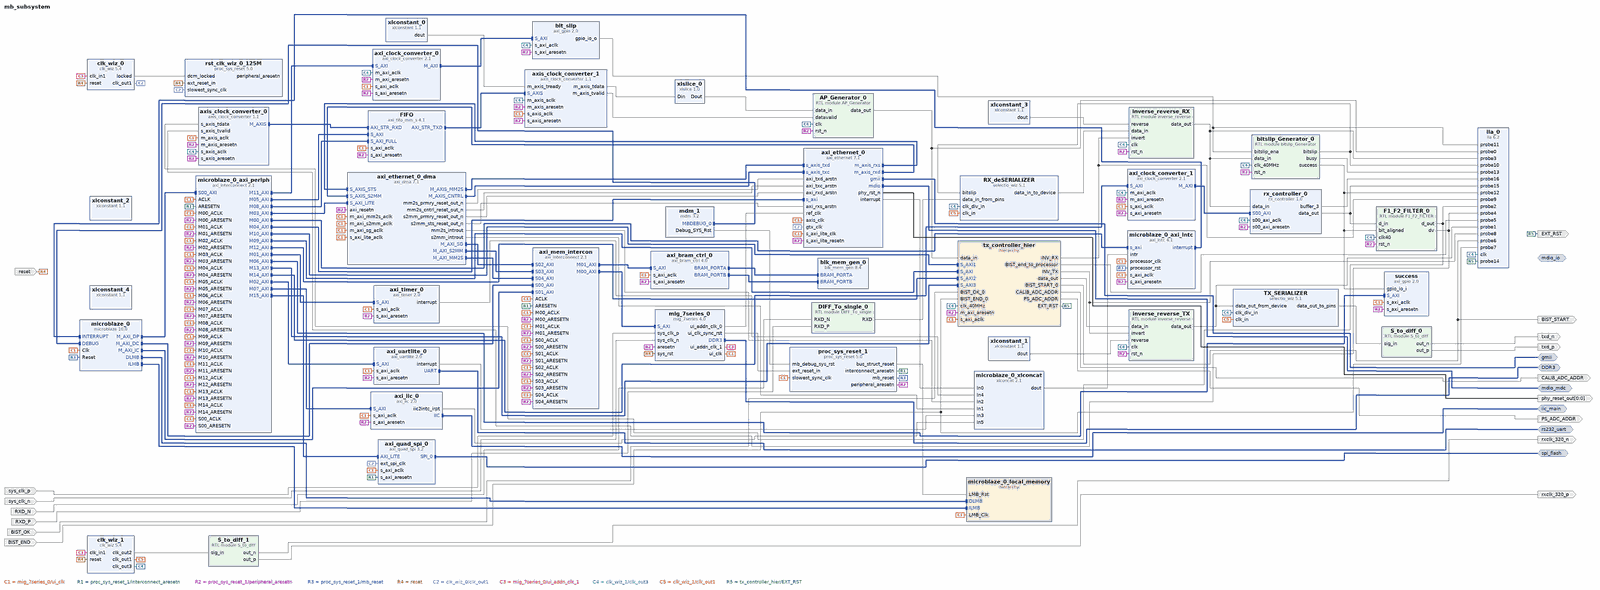
[diagram p0: block diagram of the top level, whole]
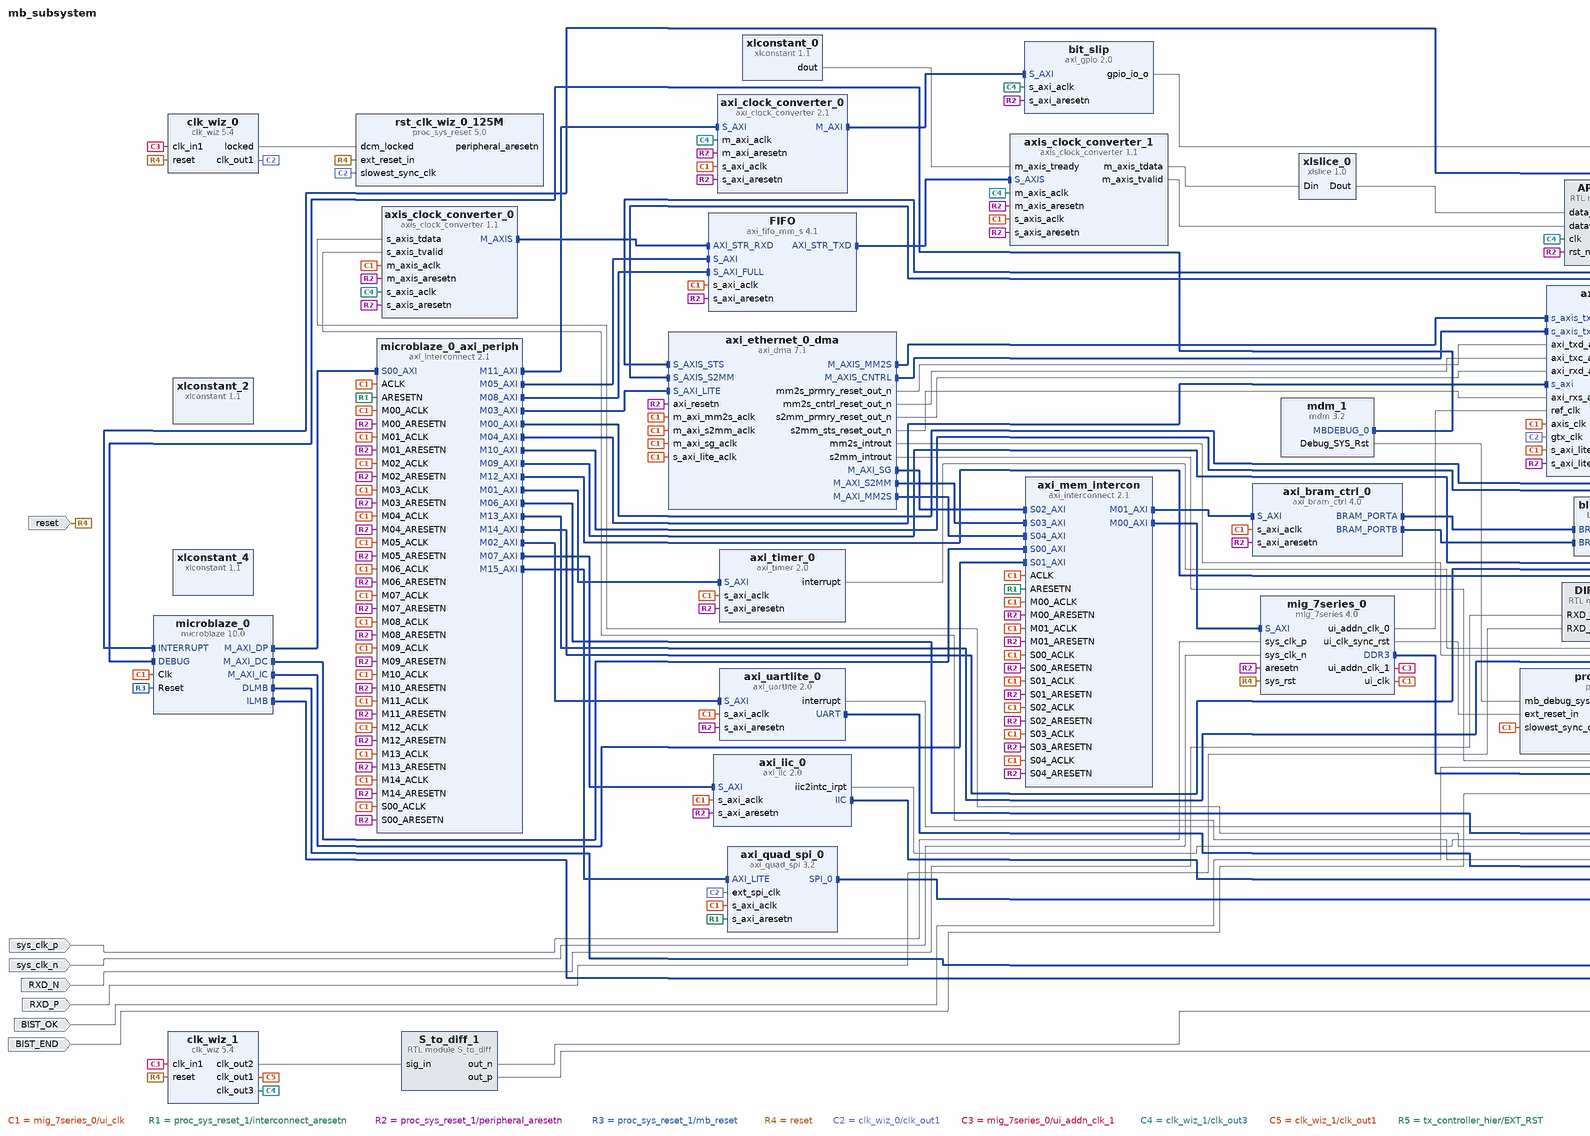
[diagram p1: block diagram of the top level, left part]
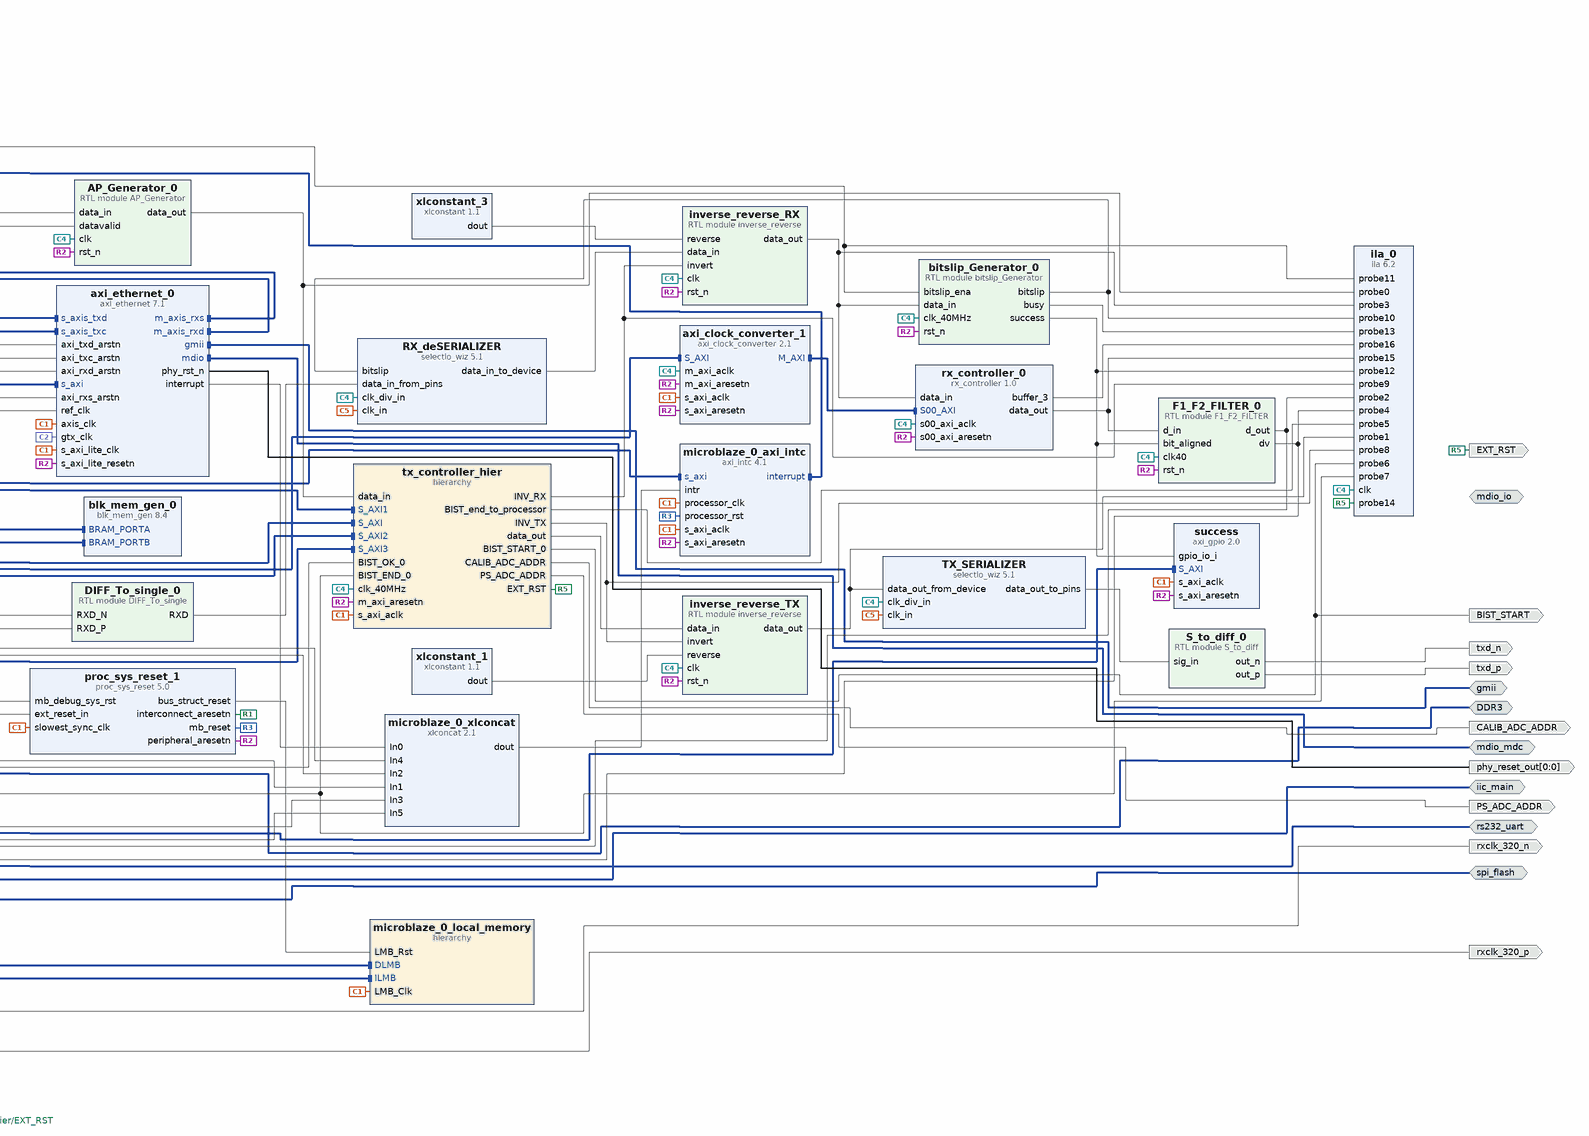
[diagram p2: block diagram of the top level, right part]
# Vivado block design mb_subsystem, xc7k325tffg900-2, Vivado 2017.4
create_bd_design mb_subsystem

create_bd_intf_port -mode Master -vlnv xilinx.com:interface:uart_rtl:1.0 rs232_uart
create_bd_intf_port -mode Master -vlnv xilinx.com:interface:ddrx_rtl:1.0 DDR3
create_bd_intf_port -mode Master -vlnv xilinx.com:interface:gmii_rtl:1.0 gmii
create_bd_intf_port -mode Master -vlnv xilinx.com:interface:mdio_rtl:1.0 mdio_mdc
create_bd_intf_port -mode Master -vlnv xilinx.com:interface:iic_rtl:1.0 iic_main
create_bd_intf_port -mode Master -vlnv xilinx.com:interface:spi_rtl:1.0 spi_flash
create_bd_intf_port -mode Master -vlnv xilinx.com:interface:mdio_io:1.0 mdio_io
create_bd_port -dir I sys_clk_p
create_bd_port -dir I sys_clk_n
create_bd_port -dir I -type rst reset
set_property -dict {CONFIG.POLARITY ACTIVE_HIGH} [get_bd_ports reset]
create_bd_port -dir O -from 0 -to 0 -type rst phy_reset_out
create_bd_port -dir I RXD_N
create_bd_port -dir I RXD_P
create_bd_port -dir O txd_p
create_bd_port -dir O txd_n
create_bd_port -dir O rxclk_320_n
create_bd_port -dir O rxclk_320_p
create_bd_port -dir I BIST_OK
create_bd_port -dir I BIST_END
create_bd_port -dir O BIST_START
create_bd_port -dir O PS_ADC_ADDR
create_bd_port -dir O CALIB_ADC_ADDR
create_bd_port -dir O EXT_RST

create_bd_cell -type hier microblaze_0_local_memory
create_bd_cell -type ip -vlnv xilinx.com:ip:axi_intc:4.1 microblaze_0_axi_intc
set_property -dict {CONFIG.C_HAS_FAST 1} [get_bd_cells microblaze_0_axi_intc]
create_bd_cell -type ip -vlnv xilinx.com:ip:xlconcat:2.1 microblaze_0_xlconcat
set_property -dict {CONFIG.NUM_PORTS 6 CONFIG.dout_width 6} [get_bd_cells microblaze_0_xlconcat]
create_bd_cell -type module -reference S_to_diff S_to_diff_0
create_bd_cell -type module -reference S_to_diff S_to_diff_1
create_bd_cell -type module -reference DIFF_To_single DIFF_To_single_0
create_bd_cell -type module -reference inverse_reverse inverse_reverse_RX
create_bd_cell -type module -reference F1_F2_FILTER F1_F2_FILTER_0
create_bd_cell -type ip -vlnv xilinx.com:ip:xlconstant:1.1 xlconstant_0
create_bd_cell -type ip -vlnv xilinx.com:ip:xlslice:1.0 xlslice_0
set_property -dict {CONFIG.DIN_TO 0 CONFIG.DIN_FROM 7 CONFIG.DOUT_WIDTH 8} [get_bd_cells xlslice_0]
create_bd_cell -type module -reference AP_Generator AP_Generator_0
create_bd_cell -type module -reference inverse_reverse inverse_reverse_TX
create_bd_cell -type ip -vlnv xilinx.com:ip:selectio_wiz:5.1 RX_deSERIALIZER
set_property -dict [list \
  CONFIG.BUS_DIR INPUTS \
  CONFIG.BUS_IO_STD LVCMOS25 \
  CONFIG.USE_SERIALIZATION true \
  CONFIG.SERIALIZATION_FACTOR 8 \
  CONFIG.SYSTEM_DATA_WIDTH 1 \
  CONFIG.SELIO_INTERFACE_TYPE NETWORKING \
  CONFIG.SELIO_BUS_IN_DELAY NONE \
  CONFIG.SELIO_CLK_IO_STD LVCMOS25 \
  CONFIG.SELIO_CLK_BUF MMCM \
  CONFIG.CLK_FWD_IO_STD LVCMOS25 \
] [get_bd_cells RX_deSERIALIZER]
create_bd_cell -type ip -vlnv xilinx.com:ip:axi_bram_ctrl:4.0 axi_bram_ctrl_0
set_property -dict {CONFIG.C_SELECT_XPM 0} [get_bd_cells axi_bram_ctrl_0]
create_bd_cell -type ip -vlnv xilinx.com:ip:axi_clock_converter:2.1 axi_clock_converter_0
create_bd_cell -type ip -vlnv xilinx.com:ip:axi_ethernet:7.1 axi_ethernet_0
set_property -dict [list \
  CONFIG.ETHERNET_BOARD_INTERFACE gmii \
  CONFIG.PHYRST_BOARD_INTERFACE phy_reset_out \
  CONFIG.MDIO_BOARD_INTERFACE mdio_mdc \
  CONFIG.rxnibblebitslice0used true \
  CONFIG.RXMEM 32k \
  CONFIG.TXMEM 32k \
  CONFIG.TXCSUM Full \
  CONFIG.RXCSUM Full \
] [get_bd_cells axi_ethernet_0]
create_bd_cell -type ip -vlnv xilinx.com:ip:axi_dma:7.1 axi_ethernet_0_dma
set_property -dict [list \
  CONFIG.c_include_mm2s_dre 1 \
  CONFIG.c_mm2s_burst_size 32 \
  CONFIG.c_sg_use_stsapp_length 1 \
  CONFIG.c_include_s2mm_dre 1 \
  CONFIG.c_s2mm_burst_size 32 \
] [get_bd_cells axi_ethernet_0_dma]
create_bd_cell -type ip -vlnv xilinx.com:ip:axi_fifo_mm_s:4.1 FIFO
set_property -dict [list \
  CONFIG.C_DATA_INTERFACE_TYPE 1 \
  CONFIG.C_RX_FIFO_PE_THRESHOLD 2 \
  CONFIG.C_RX_FIFO_PF_THRESHOLD 32763 \
  CONFIG.C_TX_FIFO_PE_THRESHOLD 2 \
  CONFIG.C_TX_FIFO_PF_THRESHOLD 130000 \
  CONFIG.C_RX_FIFO_DEPTH 32768 \
  CONFIG.C_TX_FIFO_DEPTH 131072 \
  CONFIG.C_HAS_AXIS_TDEST false \
  CONFIG.C_AXIS_TDEST_WIDTH 4 \
  CONFIG.C_USE_TX_DATA 1 \
  CONFIG.C_USE_TX_CTRL 0 \
] [get_bd_cells FIFO]
create_bd_cell -type ip -vlnv xilinx.com:ip:axi_gpio:2.0 success
set_property -dict [list \
  CONFIG.C_GPIO_WIDTH 1 \
  CONFIG.C_ALL_INPUTS 1 \
  CONFIG.USE_BOARD_FLOW true \
  CONFIG.GPIO_BOARD_INTERFACE Custom \
] [get_bd_cells success]
create_bd_cell -type ip -vlnv xilinx.com:ip:axi_gpio:2.0 bit_slip
set_property -dict {CONFIG.C_GPIO_WIDTH 1 CONFIG.C_ALL_OUTPUTS 1} [get_bd_cells bit_slip]
create_bd_cell -type ip -vlnv xilinx.com:ip:axi_iic:2.0 axi_iic_0
set_property -dict {CONFIG.USE_BOARD_FLOW true CONFIG.IIC_BOARD_INTERFACE iic_main} [get_bd_cells axi_iic_0]
create_bd_cell -type ip -vlnv xilinx.com:ip:axi_interconnect:2.1 axi_mem_intercon
set_property -dict [list \
  CONFIG.NUM_SI 5 \
  CONFIG.NUM_MI 2 \
  CONFIG.STRATEGY 2 \
  CONFIG.SYNCHRONIZATION_STAGES 2 \
  CONFIG.M00_HAS_REGSLICE 4 \
  CONFIG.M01_HAS_REGSLICE 4 \
  CONFIG.S00_HAS_REGSLICE 4 \
  CONFIG.S01_HAS_REGSLICE 4 \
  CONFIG.S02_HAS_REGSLICE 4 \
  CONFIG.S03_HAS_REGSLICE 4 \
  CONFIG.S04_HAS_REGSLICE 4 \
  CONFIG.S00_HAS_DATA_FIFO 2 \
  CONFIG.S01_HAS_DATA_FIFO 2 \
  CONFIG.S02_HAS_DATA_FIFO 2 \
  CONFIG.S03_HAS_DATA_FIFO 2 \
  CONFIG.S04_HAS_DATA_FIFO 2 \
] [get_bd_cells axi_mem_intercon]
create_bd_cell -type ip -vlnv xilinx.com:ip:axi_timer:2.0 axi_timer_0
create_bd_cell -type ip -vlnv xilinx.com:ip:axi_uartlite:2.0 axi_uartlite_0
set_property -dict [list \
  CONFIG.C_BAUDRATE 921600 \
  CONFIG.C_S_AXI_ACLK_FREQ_HZ 150150150 \
  CONFIG.USE_BOARD_FLOW true \
  CONFIG.UARTLITE_BOARD_INTERFACE rs232_uart \
] [get_bd_cells axi_uartlite_0]
create_bd_cell -type ip -vlnv xilinx.com:ip:axis_clock_converter:1.1 axis_clock_converter_0
set_property -dict {CONFIG.TDATA_NUM_BYTES 4} [get_bd_cells axis_clock_converter_0]
create_bd_cell -type ip -vlnv xilinx.com:ip:axis_clock_converter:1.1 axis_clock_converter_1
create_bd_cell -type ip -vlnv xilinx.com:ip:blk_mem_gen:8.4 blk_mem_gen_0
set_property -dict [list \
  CONFIG.Memory_Type True_Dual_Port_RAM \
  CONFIG.Enable_B Use_ENB_Pin \
  CONFIG.Use_RSTB_Pin true \
  CONFIG.Port_B_Clock 100 \
  CONFIG.Port_B_Write_Rate 50 \
  CONFIG.Port_B_Enable_Rate 100 \
  CONFIG.EN_SAFETY_CKT false \
] [get_bd_cells blk_mem_gen_0]
create_bd_cell -type ip -vlnv xilinx.com:ip:clk_wiz:5.4 clk_wiz_0
set_property -dict [list \
  CONFIG.CLKIN1_JITTER_PS 83.329999999999998 \
  CONFIG.CLKOUT1_REQUESTED_OUT_FREQ 125 \
  CONFIG.MMCM_DIVCLK_DIVIDE 3 \
  CONFIG.MMCM_CLKFBOUT_MULT_F 25.000 \
  CONFIG.MMCM_CLKIN1_PERIOD 8.333 \
  CONFIG.MMCM_CLKIN2_PERIOD 10.000 \
  CONFIG.MMCM_CLKOUT0_DIVIDE_F 8.000 \
  CONFIG.USE_BOARD_FLOW true \
  CONFIG.RESET_BOARD_INTERFACE reset \
  CONFIG.CLKOUT1_JITTER 165.993 \
  CONFIG.CLKOUT1_PHASE_ERROR 191.950 \
] [get_bd_cells clk_wiz_0]
create_bd_cell -type ip -vlnv xilinx.com:ip:clk_wiz:5.4 clk_wiz_1
set_property -dict [list \
  CONFIG.CLKIN1_JITTER_PS 83.329999999999998 \
  CONFIG.CLKOUT2_USED true \
  CONFIG.CLKOUT3_USED true \
  CONFIG.NUM_OUT_CLKS 3 \
  CONFIG.CLKOUT1_REQUESTED_OUT_FREQ 320 \
  CONFIG.CLKOUT2_REQUESTED_OUT_FREQ 320 \
  CONFIG.CLKOUT2_REQUESTED_PHASE 0 \
  CONFIG.CLKOUT3_REQUESTED_OUT_FREQ 40 \
  CONFIG.PRIM_SOURCE Single_ended_clock_capable_pin \
  CONFIG.MMCM_DIVCLK_DIVIDE 1 \
  CONFIG.MMCM_CLKFBOUT_MULT_F 8.000 \
  CONFIG.MMCM_CLKIN1_PERIOD 8.333 \
  CONFIG.MMCM_CLKIN2_PERIOD 10.000 \
  CONFIG.MMCM_CLKOUT0_DIVIDE_F 3.000 \
  CONFIG.MMCM_CLKOUT1_DIVIDE 3 \
  CONFIG.MMCM_CLKOUT1_PHASE 0.000 \
  CONFIG.MMCM_CLKOUT2_DIVIDE 24 \
  CONFIG.USE_BOARD_FLOW true \
  CONFIG.CLK_IN1_BOARD_INTERFACE Custom \
  CONFIG.RESET_BOARD_INTERFACE reset \
  CONFIG.CLKOUT1_JITTER 102.742 \
  CONFIG.CLKOUT1_PHASE_ERROR 99.820 \
  CONFIG.CLKOUT2_JITTER 102.742 \
  CONFIG.CLKOUT2_PHASE_ERROR 99.820 \
  CONFIG.CLKOUT3_JITTER 154.911 \
  CONFIG.CLKOUT3_PHASE_ERROR 99.820 \
] [get_bd_cells clk_wiz_1]
create_bd_cell -type ip -vlnv xilinx.com:ip:ila:6.2 ila_0
set_property -dict [list \
  CONFIG.C_PROBE16_WIDTH 8 \
  CONFIG.C_PROBE15_WIDTH 8 \
  CONFIG.C_PROBE3_WIDTH 8 \
  CONFIG.C_PROBE2_WIDTH 32 \
  CONFIG.C_PROBE1_WIDTH 8 \
  CONFIG.C_PROBE0_WIDTH 8 \
  CONFIG.C_NUM_OF_PROBES 17 \
  CONFIG.C_ENABLE_ILA_AXI_MON false \
  CONFIG.C_MONITOR_TYPE Native \
] [get_bd_cells ila_0]
create_bd_cell -type ip -vlnv xilinx.com:ip:mdm:3.2 mdm_1
create_bd_cell -type ip -vlnv xilinx.com:ip:microblaze:10.0 microblaze_0
set_property -dict [list \
  CONFIG.C_AREA_OPTIMIZED 2 \
  CONFIG.C_D_AXI 1 \
  CONFIG.C_I_AXI 0 \
  CONFIG.C_ENABLE_DISCRETE_PORTS 0 \
  CONFIG.G_TEMPLATE_LIST 3 \
  CONFIG.G_USE_EXCEPTIONS 0 \
  CONFIG.C_USE_MSR_INSTR 1 \
  CONFIG.C_USE_PCMP_INSTR 1 \
  CONFIG.C_USE_BARREL 1 \
  CONFIG.C_USE_DIV 1 \
  CONFIG.C_USE_HW_MUL 2 \
  CONFIG.C_USE_FPU 2 \
  CONFIG.C_DEBUG_ENABLED 1 \
  CONFIG.C_FSL_LINKS 1 \
  CONFIG.C_USE_EXTENDED_FSL_INSTR 1 \
  CONFIG.C_USE_ICACHE 1 \
  CONFIG.C_ADDR_TAG_BITS 19 \
  CONFIG.C_CACHE_BYTE_SIZE 4096 \
  CONFIG.C_ICACHE_LINE_LEN 4 \
  CONFIG.C_ICACHE_VICTIMS 0 \
  CONFIG.C_ICACHE_STREAMS 0 \
  CONFIG.C_USE_DCACHE 1 \
  CONFIG.C_DCACHE_ADDR_TAG 19 \
  CONFIG.C_DCACHE_BYTE_SIZE 4096 \
  CONFIG.C_DCACHE_LINE_LEN 4 \
  CONFIG.C_DCACHE_USE_WRITEBACK 0 \
  CONFIG.C_USE_MMU 3 \
  CONFIG.C_MMU_DTLB_SIZE 2 \
  CONFIG.C_MMU_ITLB_SIZE 1 \
  CONFIG.C_MMU_ZONES 2 \
  CONFIG.C_USE_BRANCH_TARGET_CACHE 1 \
] [get_bd_cells microblaze_0]
create_bd_cell -type ip -vlnv xilinx.com:ip:axi_interconnect:2.1 microblaze_0_axi_periph
set_property -dict {CONFIG.NUM_SI 1 CONFIG.NUM_MI 16 CONFIG.SYNCHRONIZATION_STAGES 2} [get_bd_cells microblaze_0_axi_periph]
create_bd_cell -type ip -vlnv xilinx.com:ip:mig_7series:4.0 mig_7series_0
set_property -dict [list \
  CONFIG.XML_INPUT_FILE mig_b.prj \
  CONFIG.RESET_BOARD_INTERFACE reset \
  CONFIG.MIG_DONT_TOUCH_PARAM Custom \
  CONFIG.BOARD_MIG_PARAM Custom \
] [get_bd_cells mig_7series_0]
create_bd_cell -type ip -vlnv xilinx.com:ip:proc_sys_reset:5.0 proc_sys_reset_1
create_bd_cell -type ip -vlnv xilinx.com:ip:proc_sys_reset:5.0 rst_clk_wiz_0_125M
set_property -dict {CONFIG.USE_BOARD_FLOW true CONFIG.RESET_BOARD_INTERFACE reset} [get_bd_cells rst_clk_wiz_0_125M]
create_bd_cell -type ip -vlnv xilinx.com:ip:selectio_wiz:5.1 TX_SERIALIZER
set_property -dict [list \
  CONFIG.BUS_DIR OUTPUTS \
  CONFIG.BUS_SIG_TYPE SINGLE \
  CONFIG.BUS_IO_STD LVCMOS25 \
  CONFIG.USE_SERIALIZATION true \
  CONFIG.SERIALIZATION_FACTOR 8 \
  CONFIG.SYSTEM_DATA_WIDTH 1 \
  CONFIG.SELIO_INTERFACE_TYPE NETWORKING \
  CONFIG.SELIO_BUS_IN_DELAY NONE \
  CONFIG.SELIO_CLK_SIG_TYPE SINGLE \
  CONFIG.SELIO_CLK_IO_STD LVCMOS25 \
  CONFIG.SELIO_CLK_BUF MMCM \
  CONFIG.CLK_FWD_SIG_TYPE SINGLE \
  CONFIG.CLK_FWD_IO_STD HSTL_I \
] [get_bd_cells TX_SERIALIZER]
create_bd_cell -type hier tx_controller_hier
create_bd_cell -type ip -vlnv xilinx.com:ip:xlconstant:1.1 xlconstant_1
create_bd_cell -type ip -vlnv xilinx.com:ip:xlconstant:1.1 xlconstant_2
set_property -dict {CONFIG.CONST_VAL 0} [get_bd_cells xlconstant_2]
create_bd_cell -type ip -vlnv xilinx.com:ip:xlconstant:1.1 xlconstant_3
create_bd_cell -type ip -vlnv xilinx.com:ip:xlconstant:1.1 xlconstant_4
set_property -dict {CONFIG.CONST_VAL 0} [get_bd_cells xlconstant_4]
create_bd_cell -type module -reference bitslip_Generator bitslip_Generator_0
create_bd_cell -type ip -vlnv xilinx.com:ip:axi_clock_converter:2.1 axi_clock_converter_1
create_bd_cell -type ip -vlnv cern.ch:user:rx_controller:1.0 rx_controller_0
create_bd_cell -type ip -vlnv xilinx.com:ip:axi_quad_spi:3.2 axi_quad_spi_0
set_property -dict {CONFIG.USE_BOARD_FLOW true CONFIG.QSPI_BOARD_INTERFACE spi_flash} [get_bd_cells axi_quad_spi_0]

# ---- hierarchy /microblaze_0_local_memory ----
current_bd_instance /microblaze_0_local_memory
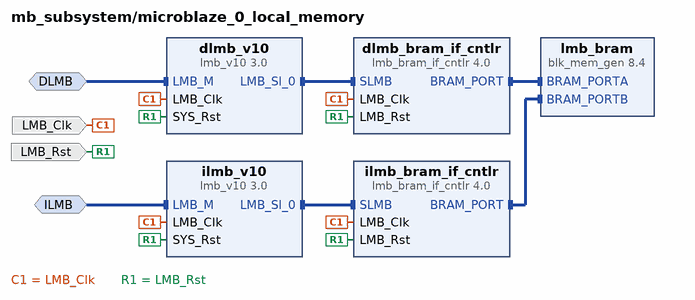
[diagram p3: block diagram inside /microblaze_0_local_memory]
create_bd_intf_pin -mode MirroredMaster -vlnv xilinx.com:interface:lmb_rtl:1.0 DLMB
create_bd_intf_pin -mode MirroredMaster -vlnv xilinx.com:interface:lmb_rtl:1.0 ILMB
create_bd_pin -dir I LMB_Clk
create_bd_pin -dir I LMB_Rst

create_bd_cell -type ip -vlnv xilinx.com:ip:lmb_v10:3.0 dlmb_v10
create_bd_cell -type ip -vlnv xilinx.com:ip:lmb_v10:3.0 ilmb_v10
create_bd_cell -type ip -vlnv xilinx.com:ip:lmb_bram_if_cntlr:4.0 dlmb_bram_if_cntlr
create_bd_cell -type ip -vlnv xilinx.com:ip:lmb_bram_if_cntlr:4.0 ilmb_bram_if_cntlr
create_bd_cell -type ip -vlnv xilinx.com:ip:blk_mem_gen:8.4 lmb_bram
set_property -dict [list \
  CONFIG.Memory_Type True_Dual_Port_RAM \
  CONFIG.Enable_B Use_ENB_Pin \
  CONFIG.Use_RSTB_Pin true \
  CONFIG.Port_B_Clock 100 \
  CONFIG.Port_B_Write_Rate 50 \
  CONFIG.Port_B_Enable_Rate 100 \
  CONFIG.EN_SAFETY_CKT false \
] [get_bd_cells lmb_bram]

# ---- hierarchy /tx_controller_hier ----
current_bd_instance /tx_controller_hier
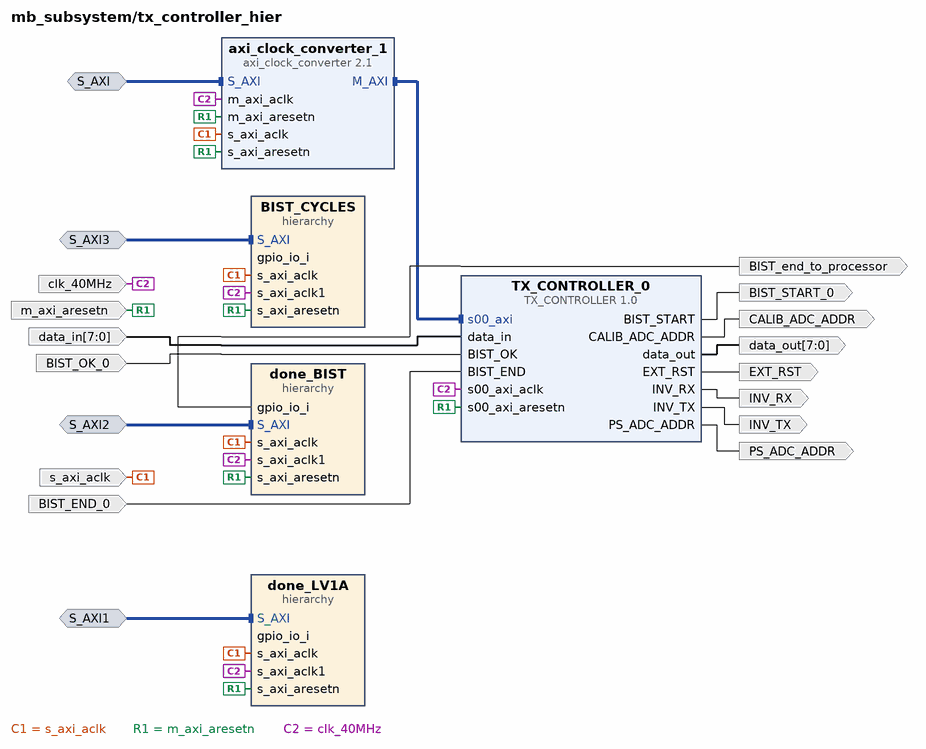
[diagram p4: block diagram inside /tx_controller_hier]
create_bd_intf_pin -mode Slave -vlnv xilinx.com:interface:aximm_rtl:1.0 S_AXI
create_bd_intf_pin -mode Slave -vlnv xilinx.com:interface:aximm_rtl:1.0 S_AXI1
create_bd_intf_pin -mode Slave -vlnv xilinx.com:interface:aximm_rtl:1.0 S_AXI2
create_bd_intf_pin -mode Slave -vlnv xilinx.com:interface:aximm_rtl:1.0 S_AXI3
create_bd_pin -dir I -type clk s_axi_aclk
create_bd_pin -dir I -type rst m_axi_aresetn
create_bd_pin -dir I clk_40MHz
create_bd_pin -dir O -from 7 -to 0 data_out
create_bd_pin -dir I -from 7 -to 0 data_in
create_bd_pin -dir I BIST_OK_0
create_bd_pin -dir I BIST_END_0
create_bd_pin -dir O BIST_START_0
create_bd_pin -dir O BIST_end_to_processor
create_bd_pin -dir O PS_ADC_ADDR
create_bd_pin -dir O CALIB_ADC_ADDR
create_bd_pin -dir O INV_TX
create_bd_pin -dir O INV_RX
create_bd_pin -dir O -type rst EXT_RST

create_bd_cell -type ip -vlnv xilinx.com:ip:axi_clock_converter:2.1 axi_clock_converter_1
create_bd_cell -type hier done_LV1A
create_bd_cell -type hier done_BIST
create_bd_cell -type hier BIST_CYCLES
create_bd_cell -type ip -vlnv cern.ch:user:TX_CONTROLLER:1.0 TX_CONTROLLER_0

# ---- hierarchy /tx_controller_hier/done_LV1A ----
current_bd_instance /tx_controller_hier/done_LV1A
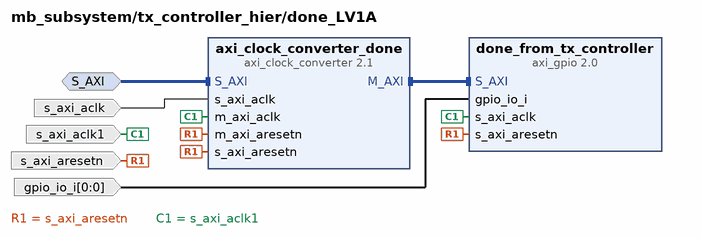
[diagram p5: block diagram inside /tx_controller_hier/done_LV1A]
create_bd_intf_pin -mode Slave -vlnv xilinx.com:interface:aximm_rtl:1.0 S_AXI
create_bd_pin -dir I -type clk s_axi_aclk
create_bd_pin -dir I -type rst s_axi_aresetn
create_bd_pin -dir I -type clk s_axi_aclk1
create_bd_pin -dir I -from 0 -to 0 gpio_io_i

create_bd_cell -type ip -vlnv xilinx.com:ip:axi_clock_converter:2.1 axi_clock_converter_done
create_bd_cell -type ip -vlnv xilinx.com:ip:axi_gpio:2.0 done_from_tx_controller
set_property -dict {CONFIG.C_GPIO_WIDTH 1 CONFIG.C_IS_DUAL 0 CONFIG.C_ALL_INPUTS 1} [get_bd_cells done_from_tx_controller]

# ---- hierarchy /tx_controller_hier/done_BIST ----
current_bd_instance /tx_controller_hier/done_BIST
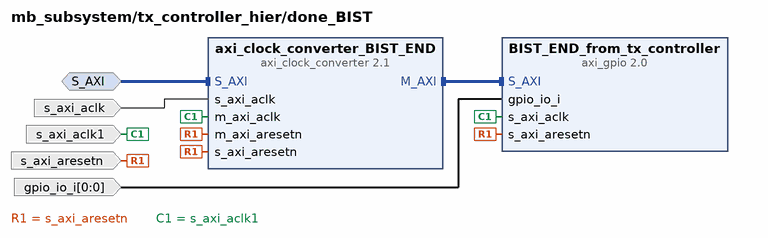
[diagram p6: block diagram inside /tx_controller_hier/done_BIST]
create_bd_intf_pin -mode Slave -vlnv xilinx.com:interface:aximm_rtl:1.0 S_AXI
create_bd_pin -dir I -type clk s_axi_aclk
create_bd_pin -dir I -type rst s_axi_aresetn
create_bd_pin -dir I -type clk s_axi_aclk1
create_bd_pin -dir I -from 0 -to 0 gpio_io_i

create_bd_cell -type ip -vlnv xilinx.com:ip:axi_clock_converter:2.1 axi_clock_converter_BIST_END
create_bd_cell -type ip -vlnv xilinx.com:ip:axi_gpio:2.0 BIST_END_from_tx_controller
set_property -dict {CONFIG.C_GPIO_WIDTH 1 CONFIG.C_IS_DUAL 0 CONFIG.C_ALL_INPUTS 1} [get_bd_cells BIST_END_from_tx_controller]

# ---- hierarchy /tx_controller_hier/BIST_CYCLES ----
current_bd_instance /tx_controller_hier/BIST_CYCLES
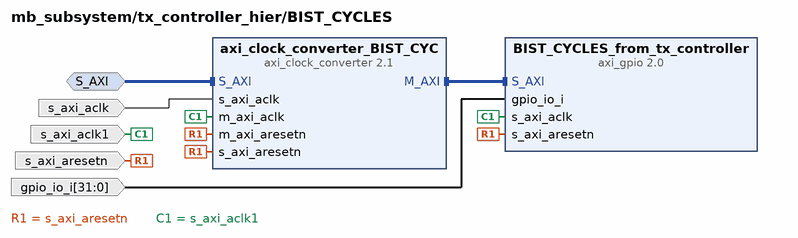
[diagram p7: block diagram inside /tx_controller_hier/BIST_CYCLES]
create_bd_intf_pin -mode Slave -vlnv xilinx.com:interface:aximm_rtl:1.0 S_AXI
create_bd_pin -dir I -type clk s_axi_aclk
create_bd_pin -dir I -type rst s_axi_aresetn
create_bd_pin -dir I -type clk s_axi_aclk1
create_bd_pin -dir I -from 31 -to 0 gpio_io_i

create_bd_cell -type ip -vlnv xilinx.com:ip:axi_clock_converter:2.1 axi_clock_converter_BIST_CYC
create_bd_cell -type ip -vlnv xilinx.com:ip:axi_gpio:2.0 BIST_CYCLES_from_tx_controller
set_property -dict {CONFIG.C_GPIO_WIDTH 32 CONFIG.C_IS_DUAL 0 CONFIG.C_ALL_INPUTS 1} [get_bd_cells BIST_CYCLES_from_tx_controller]

# ---- connections ----

current_bd_instance /microblaze_0_local_memory
connect_bd_intf_net -intf_net microblaze_0_dlmb_bus [get_bd_intf_pins dlmb_v10/LMB_Sl_0] [get_bd_intf_pins dlmb_bram_if_cntlr/SLMB]
connect_bd_intf_net -intf_net microblaze_0_ilmb_bus [get_bd_intf_pins ilmb_v10/LMB_Sl_0] [get_bd_intf_pins ilmb_bram_if_cntlr/SLMB]
connect_bd_intf_net -intf_net microblaze_0_dlmb_cntlr [get_bd_intf_pins dlmb_bram_if_cntlr/BRAM_PORT] [get_bd_intf_pins lmb_bram/BRAM_PORTA]
connect_bd_intf_net -intf_net microblaze_0_ilmb_cntlr [get_bd_intf_pins ilmb_bram_if_cntlr/BRAM_PORT] [get_bd_intf_pins lmb_bram/BRAM_PORTB]
connect_bd_intf_net -intf_net microblaze_0_dlmb [get_bd_intf_pins DLMB] [get_bd_intf_pins dlmb_v10/LMB_M]
connect_bd_intf_net -intf_net microblaze_0_ilmb [get_bd_intf_pins ILMB] [get_bd_intf_pins ilmb_v10/LMB_M]
connect_bd_net -net microblaze_0_Clk [get_bd_pins LMB_Clk] \
  [get_bd_pins dlmb_v10/LMB_Clk] [get_bd_pins ilmb_v10/LMB_Clk] [get_bd_pins dlmb_bram_if_cntlr/LMB_Clk] \
  [get_bd_pins ilmb_bram_if_cntlr/LMB_Clk]
connect_bd_net -net proc_sys_reset_1_bus_struct_reset [get_bd_pins LMB_Rst] \
  [get_bd_pins dlmb_v10/SYS_Rst] [get_bd_pins ilmb_v10/SYS_Rst] [get_bd_pins dlmb_bram_if_cntlr/LMB_Rst] \
  [get_bd_pins ilmb_bram_if_cntlr/LMB_Rst]

current_bd_instance /tx_controller_hier
connect_bd_intf_net [get_bd_intf_pins axi_clock_converter_1/M_AXI] [get_bd_intf_pins TX_CONTROLLER_0/s00_axi]
connect_bd_intf_net [get_bd_intf_pins S_AXI] [get_bd_intf_pins axi_clock_converter_1/S_AXI]
connect_bd_intf_net [get_bd_intf_pins S_AXI1] [get_bd_intf_pins done_LV1A/S_AXI]
connect_bd_intf_net [get_bd_intf_pins S_AXI2] [get_bd_intf_pins done_BIST/S_AXI]
connect_bd_intf_net [get_bd_intf_pins S_AXI3] [get_bd_intf_pins BIST_CYCLES/S_AXI]
# net TX_CONTROLLER_0_done has one end: done_LV1A/gpio_io_i
connect_bd_net -net microblaze_0_Clk [get_bd_pins s_axi_aclk] \
  [get_bd_pins axi_clock_converter_1/s_axi_aclk] [get_bd_pins done_LV1A/s_axi_aclk] [get_bd_pins done_BIST/s_axi_aclk] \
  [get_bd_pins BIST_CYCLES/s_axi_aclk]
connect_bd_net -net proc_sys_reset_1_peripheral_aresetn [get_bd_pins m_axi_aresetn] \
  [get_bd_pins axi_clock_converter_1/m_axi_aresetn] [get_bd_pins axi_clock_converter_1/s_axi_aresetn] \
  [get_bd_pins done_LV1A/s_axi_aresetn] [get_bd_pins done_BIST/s_axi_aresetn] [get_bd_pins BIST_CYCLES/s_axi_aresetn] \
  [get_bd_pins TX_CONTROLLER_0/s00_axi_aresetn]
connect_bd_net [get_bd_pins clk_40MHz] \
  [get_bd_pins axi_clock_converter_1/m_axi_aclk] [get_bd_pins done_LV1A/s_axi_aclk1] [get_bd_pins done_BIST/s_axi_aclk1] \
  [get_bd_pins BIST_CYCLES/s_axi_aclk1] [get_bd_pins TX_CONTROLLER_0/s00_axi_aclk]
connect_bd_net [get_bd_pins TX_CONTROLLER_0/data_out] [get_bd_pins data_out]
connect_bd_net -net AP_Generator_0_data_out [get_bd_pins data_in] [get_bd_pins TX_CONTROLLER_0/data_in]
connect_bd_net -net BIST_OK_0_1 [get_bd_pins BIST_OK_0] [get_bd_pins TX_CONTROLLER_0/BIST_OK]
connect_bd_net -net BIST_END_0_1 [get_bd_pins BIST_END_0] [get_bd_pins TX_CONTROLLER_0/BIST_END]
connect_bd_net [get_bd_pins TX_CONTROLLER_0/BIST_START] [get_bd_pins BIST_START_0]
connect_bd_net -net TX_CONTROLLER_0_BIST_end_to_processor [get_bd_pins BIST_end_to_processor] [get_bd_pins done_BIST/gpio_io_i]
# net gpio_io_i_1 has one end: BIST_CYCLES/gpio_io_i
connect_bd_net [get_bd_pins TX_CONTROLLER_0/PS_ADC_ADDR] [get_bd_pins PS_ADC_ADDR]
connect_bd_net [get_bd_pins TX_CONTROLLER_0/CALIB_ADC_ADDR] [get_bd_pins CALIB_ADC_ADDR]
connect_bd_net [get_bd_pins TX_CONTROLLER_0/INV_TX] [get_bd_pins INV_TX]
connect_bd_net [get_bd_pins TX_CONTROLLER_0/INV_RX] [get_bd_pins INV_RX]
connect_bd_net [get_bd_pins TX_CONTROLLER_0/EXT_RST] [get_bd_pins EXT_RST]

current_bd_instance /tx_controller_hier/done_LV1A
connect_bd_intf_net -intf_net axi_clock_converter_1_M_AXI [get_bd_intf_pins axi_clock_converter_done/M_AXI] [get_bd_intf_pins done_from_tx_controller/S_AXI]
connect_bd_intf_net [get_bd_intf_pins S_AXI] [get_bd_intf_pins axi_clock_converter_done/S_AXI]
connect_bd_net -net microblaze_0_Clk [get_bd_pins s_axi_aclk] [get_bd_pins axi_clock_converter_done/s_axi_aclk]
connect_bd_net -net proc_sys_reset_1_peripheral_aresetn [get_bd_pins s_axi_aresetn] \
  [get_bd_pins done_from_tx_controller/s_axi_aresetn] [get_bd_pins axi_clock_converter_done/m_axi_aresetn] \
  [get_bd_pins axi_clock_converter_done/s_axi_aresetn]
connect_bd_net -net CLK_40mhZ [get_bd_pins s_axi_aclk1] \
  [get_bd_pins done_from_tx_controller/s_axi_aclk] [get_bd_pins axi_clock_converter_done/m_axi_aclk]
connect_bd_net -net TX_CONTROLLER_0_done [get_bd_pins gpio_io_i] [get_bd_pins done_from_tx_controller/gpio_io_i]

current_bd_instance /tx_controller_hier/done_BIST
connect_bd_intf_net -intf_net axi_clock_converter_1_M_AXI [get_bd_intf_pins axi_clock_converter_BIST_END/M_AXI] [get_bd_intf_pins BIST_END_from_tx_controller/S_AXI]
connect_bd_intf_net [get_bd_intf_pins S_AXI] [get_bd_intf_pins axi_clock_converter_BIST_END/S_AXI]
connect_bd_net -net microblaze_0_Clk [get_bd_pins s_axi_aclk] [get_bd_pins axi_clock_converter_BIST_END/s_axi_aclk]
connect_bd_net -net proc_sys_reset_1_peripheral_aresetn [get_bd_pins s_axi_aresetn] \
  [get_bd_pins BIST_END_from_tx_controller/s_axi_aresetn] [get_bd_pins axi_clock_converter_BIST_END/m_axi_aresetn] \
  [get_bd_pins axi_clock_converter_BIST_END/s_axi_aresetn]
connect_bd_net -net CLK_40mhZ [get_bd_pins s_axi_aclk1] \
  [get_bd_pins BIST_END_from_tx_controller/s_axi_aclk] [get_bd_pins axi_clock_converter_BIST_END/m_axi_aclk]
connect_bd_net -net TX_CONTROLLER_0_done [get_bd_pins gpio_io_i] [get_bd_pins BIST_END_from_tx_controller/gpio_io_i]

current_bd_instance /tx_controller_hier/BIST_CYCLES
connect_bd_intf_net -intf_net axi_clock_converter_1_M_AXI [get_bd_intf_pins axi_clock_converter_BIST_CYC/M_AXI] [get_bd_intf_pins BIST_CYCLES_from_tx_controller/S_AXI]
connect_bd_intf_net [get_bd_intf_pins S_AXI] [get_bd_intf_pins axi_clock_converter_BIST_CYC/S_AXI]
connect_bd_net -net microblaze_0_Clk [get_bd_pins s_axi_aclk] [get_bd_pins axi_clock_converter_BIST_CYC/s_axi_aclk]
connect_bd_net -net proc_sys_reset_1_peripheral_aresetn [get_bd_pins s_axi_aresetn] \
  [get_bd_pins BIST_CYCLES_from_tx_controller/s_axi_aresetn] [get_bd_pins axi_clock_converter_BIST_CYC/m_axi_aresetn] \
  [get_bd_pins axi_clock_converter_BIST_CYC/s_axi_aresetn]
connect_bd_net -net CLK_40mhZ [get_bd_pins s_axi_aclk1] \
  [get_bd_pins BIST_CYCLES_from_tx_controller/s_axi_aclk] [get_bd_pins axi_clock_converter_BIST_CYC/m_axi_aclk]
connect_bd_net -net TX_CONTROLLER_0_done [get_bd_pins gpio_io_i] [get_bd_pins BIST_CYCLES_from_tx_controller/gpio_io_i]

current_bd_instance /
connect_bd_intf_net [get_bd_intf_pins microblaze_0/DLMB] [get_bd_intf_pins microblaze_0_local_memory/DLMB]
connect_bd_intf_net [get_bd_intf_pins microblaze_0/ILMB] [get_bd_intf_pins microblaze_0_local_memory/ILMB]
connect_bd_intf_net -intf_net microblaze_0_axi_dp [get_bd_intf_pins microblaze_0_axi_periph/S00_AXI] [get_bd_intf_pins microblaze_0/M_AXI_DP]
connect_bd_intf_net [get_bd_intf_pins microblaze_0_axi_intc/interrupt] [get_bd_intf_pins microblaze_0/INTERRUPT]
connect_bd_intf_net -intf_net microblaze_0_intc_axi [get_bd_intf_pins microblaze_0_axi_periph/M00_AXI] [get_bd_intf_pins microblaze_0_axi_intc/s_axi]
connect_bd_intf_net [get_bd_intf_pins microblaze_0_axi_periph/M01_AXI] [get_bd_intf_pins axi_timer_0/S_AXI]
connect_bd_intf_net [get_bd_intf_pins microblaze_0_axi_periph/M02_AXI] [get_bd_intf_pins axi_uartlite_0/S_AXI]
connect_bd_intf_net [get_bd_intf_pins axi_bram_ctrl_0/BRAM_PORTA] [get_bd_intf_pins blk_mem_gen_0/BRAM_PORTA]
connect_bd_intf_net [get_bd_intf_pins axi_bram_ctrl_0/BRAM_PORTB] [get_bd_intf_pins blk_mem_gen_0/BRAM_PORTB]
connect_bd_intf_net [get_bd_intf_pins axi_mem_intercon/M00_AXI] [get_bd_intf_pins mig_7series_0/S_AXI]
connect_bd_intf_net [get_bd_intf_pins axi_mem_intercon/M01_AXI] [get_bd_intf_pins axi_bram_ctrl_0/S_AXI]
connect_bd_intf_net [get_bd_intf_pins axi_ethernet_0_dma/M_AXIS_MM2S] [get_bd_intf_pins axi_ethernet_0/s_axis_txd]
connect_bd_intf_net [get_bd_intf_pins axi_ethernet_0_dma/M_AXIS_CNTRL] [get_bd_intf_pins axi_ethernet_0/s_axis_txc]
connect_bd_intf_net [get_bd_intf_pins axi_ethernet_0_dma/S_AXIS_STS] [get_bd_intf_pins axi_ethernet_0/m_axis_rxs]
connect_bd_intf_net [get_bd_intf_pins axi_ethernet_0_dma/S_AXIS_S2MM] [get_bd_intf_pins axi_ethernet_0/m_axis_rxd]
connect_bd_intf_net [get_bd_intf_pins axi_ethernet_0_dma/M_AXI_SG] [get_bd_intf_pins axi_mem_intercon/S02_AXI]
connect_bd_intf_net [get_bd_intf_pins microblaze_0_axi_periph/M03_AXI] [get_bd_intf_pins axi_ethernet_0_dma/S_AXI_LITE]
connect_bd_intf_net [get_bd_intf_pins axi_ethernet_0_dma/M_AXI_S2MM] [get_bd_intf_pins axi_mem_intercon/S03_AXI]
connect_bd_intf_net [get_bd_intf_pins axi_ethernet_0_dma/M_AXI_MM2S] [get_bd_intf_pins axi_mem_intercon/S04_AXI]
connect_bd_intf_net [get_bd_intf_pins microblaze_0_axi_periph/M04_AXI] [get_bd_intf_pins axi_ethernet_0/s_axi]
connect_bd_intf_net [get_bd_intf_pins microblaze_0_axi_periph/M11_AXI] [get_bd_intf_pins axi_clock_converter_0/S_AXI]
connect_bd_intf_net [get_bd_intf_pins microblaze_0_axi_periph/M06_AXI] [get_bd_intf_pins success/S_AXI]
connect_bd_intf_net [get_bd_intf_pins bit_slip/S_AXI] [get_bd_intf_pins axi_clock_converter_0/M_AXI]
connect_bd_intf_net -intf_net Receiver_logic_M_AXIS [get_bd_intf_pins axis_clock_converter_0/M_AXIS] [get_bd_intf_pins FIFO/AXI_STR_RXD]
connect_bd_intf_net [get_bd_intf_pins microblaze_0_axi_periph/M05_AXI] [get_bd_intf_pins FIFO/S_AXI]
connect_bd_intf_net -intf_net output_fifo_AXI_STR_TXD [get_bd_intf_pins FIFO/AXI_STR_TXD] [get_bd_intf_pins axis_clock_converter_1/S_AXIS]
connect_bd_intf_net [get_bd_intf_pins microblaze_0_axi_periph/M07_AXI] [get_bd_intf_pins axi_iic_0/S_AXI]
connect_bd_intf_net [get_bd_intf_pins microblaze_0/M_AXI_DC] [get_bd_intf_pins axi_mem_intercon/S00_AXI]
connect_bd_intf_net [get_bd_intf_pins axi_mem_intercon/S01_AXI] [get_bd_intf_pins microblaze_0/M_AXI_IC]
connect_bd_intf_net [get_bd_intf_pins microblaze_0/DEBUG] [get_bd_intf_pins mdm_1/MBDEBUG_0]
connect_bd_intf_net [get_bd_intf_pins microblaze_0_axi_periph/M08_AXI] [get_bd_intf_pins FIFO/S_AXI_FULL]
connect_bd_intf_net [get_bd_intf_pins microblaze_0_axi_periph/M10_AXI] [get_bd_intf_pins tx_controller_hier/S_AXI1]
connect_bd_intf_net [get_bd_intf_pins tx_controller_hier/S_AXI] [get_bd_intf_pins microblaze_0_axi_periph/M09_AXI]
connect_bd_intf_net [get_bd_intf_pins microblaze_0_axi_periph/M12_AXI] [get_bd_intf_pins tx_controller_hier/S_AXI2]
connect_bd_intf_net [get_bd_intf_pins microblaze_0_axi_periph/M13_AXI] [get_bd_intf_pins tx_controller_hier/S_AXI3]
connect_bd_intf_net [get_bd_intf_pins axi_clock_converter_1/M_AXI] [get_bd_intf_pins rx_controller_0/S00_AXI]
connect_bd_intf_net [get_bd_intf_pins microblaze_0_axi_periph/M14_AXI] [get_bd_intf_pins axi_clock_converter_1/S_AXI]
connect_bd_intf_net [get_bd_intf_pins axi_quad_spi_0/AXI_LITE] [get_bd_intf_pins microblaze_0_axi_periph/M15_AXI]
connect_bd_intf_net [get_bd_intf_ports rs232_uart] [get_bd_intf_pins axi_uartlite_0/UART]
connect_bd_intf_net [get_bd_intf_ports DDR3] [get_bd_intf_pins mig_7series_0/DDR3]
connect_bd_intf_net [get_bd_intf_ports gmii] [get_bd_intf_pins axi_ethernet_0/gmii]
connect_bd_intf_net [get_bd_intf_ports mdio_mdc] [get_bd_intf_pins axi_ethernet_0/mdio]
connect_bd_intf_net [get_bd_intf_ports iic_main] [get_bd_intf_pins axi_iic_0/IIC]
connect_bd_intf_net [get_bd_intf_ports spi_flash] [get_bd_intf_pins axi_quad_spi_0/SPI_0]
connect_bd_net -net microblaze_0_intr [get_bd_pins microblaze_0_xlconcat/dout] [get_bd_pins microblaze_0_axi_intc/intr]
connect_bd_net -net microblaze_0_Clk [get_bd_pins mig_7series_0/ui_clk] \
  [get_bd_pins microblaze_0_axi_intc/s_axi_aclk] [get_bd_pins microblaze_0_axi_intc/processor_clk] \
  [get_bd_pins axi_bram_ctrl_0/s_axi_aclk] [get_bd_pins axi_clock_converter_0/s_axi_aclk] \
  [get_bd_pins axi_ethernet_0/s_axi_lite_clk] [get_bd_pins axi_ethernet_0/axis_clk] \
  [get_bd_pins axi_ethernet_0_dma/s_axi_lite_aclk] [get_bd_pins axi_ethernet_0_dma/m_axi_sg_aclk] \
  [get_bd_pins axi_ethernet_0_dma/m_axi_mm2s_aclk] [get_bd_pins axi_ethernet_0_dma/m_axi_s2mm_aclk] \
  [get_bd_pins FIFO/s_axi_aclk] [get_bd_pins success/s_axi_aclk] [get_bd_pins axi_iic_0/s_axi_aclk] \
  [get_bd_pins axi_timer_0/s_axi_aclk] [get_bd_pins axi_uartlite_0/s_axi_aclk] \
  [get_bd_pins axis_clock_converter_0/m_axis_aclk] [get_bd_pins axis_clock_converter_1/s_axis_aclk] \
  [get_bd_pins microblaze_0/Clk] [get_bd_pins proc_sys_reset_1/slowest_sync_clk] \
  [get_bd_pins axi_clock_converter_1/s_axi_aclk] [get_bd_pins microblaze_0_local_memory/LMB_Clk] \
  [get_bd_pins axi_mem_intercon/ACLK] [get_bd_pins axi_mem_intercon/S00_ACLK] [get_bd_pins axi_mem_intercon/S01_ACLK] \
  [get_bd_pins axi_mem_intercon/S02_ACLK] [get_bd_pins axi_mem_intercon/S03_ACLK] [get_bd_pins axi_mem_intercon/S04_ACLK] \
  [get_bd_pins axi_mem_intercon/M00_ACLK] [get_bd_pins axi_mem_intercon/M01_ACLK] [get_bd_pins microblaze_0_axi_periph/ACLK] \
  [get_bd_pins microblaze_0_axi_periph/S00_ACLK] [get_bd_pins microblaze_0_axi_periph/M00_ACLK] \
  [get_bd_pins microblaze_0_axi_periph/M01_ACLK] [get_bd_pins microblaze_0_axi_periph/M02_ACLK] \
  [get_bd_pins microblaze_0_axi_periph/M03_ACLK] [get_bd_pins microblaze_0_axi_periph/M04_ACLK] \
  [get_bd_pins microblaze_0_axi_periph/M05_ACLK] [get_bd_pins microblaze_0_axi_periph/M06_ACLK] \
  [get_bd_pins microblaze_0_axi_periph/M07_ACLK] [get_bd_pins microblaze_0_axi_periph/M08_ACLK] \
  [get_bd_pins microblaze_0_axi_periph/M09_ACLK] [get_bd_pins microblaze_0_axi_periph/M10_ACLK] \
  [get_bd_pins microblaze_0_axi_periph/M11_ACLK] [get_bd_pins microblaze_0_axi_periph/M12_ACLK] \
  [get_bd_pins microblaze_0_axi_periph/M13_ACLK] [get_bd_pins tx_controller_hier/s_axi_aclk] \
  [get_bd_pins microblaze_0_axi_periph/M14_ACLK] [get_bd_pins axi_quad_spi_0/s_axi_aclk]
connect_bd_net [get_bd_pins proc_sys_reset_1/bus_struct_reset] [get_bd_pins microblaze_0_local_memory/LMB_Rst]
connect_bd_net [get_bd_pins proc_sys_reset_1/interconnect_aresetn] \
  [get_bd_pins axi_mem_intercon/ARESETN] [get_bd_pins microblaze_0_axi_periph/ARESETN] \
  [get_bd_pins axi_quad_spi_0/s_axi_aresetn]
connect_bd_net [get_bd_pins mdm_1/Debug_SYS_Rst] [get_bd_pins proc_sys_reset_1/mb_debug_sys_rst]
connect_bd_net [get_bd_pins proc_sys_reset_1/peripheral_aresetn] \
  [get_bd_pins microblaze_0_axi_intc/s_axi_aresetn] [get_bd_pins inverse_reverse_RX/rst_n] [get_bd_pins F1_F2_FILTER_0/rst_n] \
  [get_bd_pins AP_Generator_0/rst_n] [get_bd_pins inverse_reverse_TX/rst_n] [get_bd_pins axi_bram_ctrl_0/s_axi_aresetn] \
  [get_bd_pins axi_clock_converter_0/s_axi_aresetn] [get_bd_pins axi_clock_converter_0/m_axi_aresetn] \
  [get_bd_pins axi_ethernet_0/s_axi_lite_resetn] [get_bd_pins axi_ethernet_0_dma/axi_resetn] [get_bd_pins FIFO/s_axi_aresetn] \
  [get_bd_pins success/s_axi_aresetn] [get_bd_pins bit_slip/s_axi_aresetn] [get_bd_pins axi_iic_0/s_axi_aresetn] \
  [get_bd_pins axi_timer_0/s_axi_aresetn] [get_bd_pins axi_uartlite_0/s_axi_aresetn] \
  [get_bd_pins axis_clock_converter_0/s_axis_aresetn] [get_bd_pins axis_clock_converter_0/m_axis_aresetn] \
  [get_bd_pins axis_clock_converter_1/s_axis_aresetn] [get_bd_pins axis_clock_converter_1/m_axis_aresetn] \
  [get_bd_pins mig_7series_0/aresetn] [get_bd_pins bitslip_Generator_0/rst_n] \
  [get_bd_pins axi_clock_converter_1/m_axi_aresetn] [get_bd_pins axi_clock_converter_1/s_axi_aresetn] \
  [get_bd_pins rx_controller_0/s00_axi_aresetn] [get_bd_pins axi_mem_intercon/S00_ARESETN] \
  [get_bd_pins axi_mem_intercon/S01_ARESETN] [get_bd_pins axi_mem_intercon/S02_ARESETN] \
  [get_bd_pins axi_mem_intercon/S03_ARESETN] [get_bd_pins axi_mem_intercon/S04_ARESETN] \
  [get_bd_pins axi_mem_intercon/M00_ARESETN] [get_bd_pins axi_mem_intercon/M01_ARESETN] \
  [get_bd_pins microblaze_0_axi_periph/S00_ARESETN] [get_bd_pins microblaze_0_axi_periph/M00_ARESETN] \
  [get_bd_pins microblaze_0_axi_periph/M01_ARESETN] [get_bd_pins microblaze_0_axi_periph/M02_ARESETN] \
  [get_bd_pins microblaze_0_axi_periph/M03_ARESETN] [get_bd_pins microblaze_0_axi_periph/M04_ARESETN] \
  [get_bd_pins microblaze_0_axi_periph/M05_ARESETN] [get_bd_pins microblaze_0_axi_periph/M06_ARESETN] \
  [get_bd_pins microblaze_0_axi_periph/M07_ARESETN] [get_bd_pins microblaze_0_axi_periph/M08_ARESETN] \
  [get_bd_pins microblaze_0_axi_periph/M09_ARESETN] [get_bd_pins microblaze_0_axi_periph/M10_ARESETN] \
  [get_bd_pins microblaze_0_axi_periph/M11_ARESETN] [get_bd_pins microblaze_0_axi_periph/M12_ARESETN] \
  [get_bd_pins microblaze_0_axi_periph/M13_ARESETN] [get_bd_pins tx_controller_hier/m_axi_aresetn] \
  [get_bd_pins microblaze_0_axi_periph/M14_ARESETN]
connect_bd_net [get_bd_pins proc_sys_reset_1/mb_reset] [get_bd_pins microblaze_0_axi_intc/processor_rst] [get_bd_pins microblaze_0/Reset]
connect_bd_net [get_bd_pins mig_7series_0/ui_clk_sync_rst] [get_bd_pins proc_sys_reset_1/ext_reset_in]
connect_bd_net [get_bd_pins axi_timer_0/interrupt] [get_bd_pins microblaze_0_xlconcat/In4]
connect_bd_net [get_bd_pins axi_uartlite_0/interrupt] [get_bd_pins microblaze_0_xlconcat/In3]
connect_bd_net [get_bd_ports sys_clk_p] [get_bd_pins mig_7series_0/sys_clk_p]
connect_bd_net [get_bd_ports sys_clk_n] [get_bd_pins mig_7series_0/sys_clk_n]
connect_bd_net [get_bd_ports reset] \
  [get_bd_pins clk_wiz_0/reset] [get_bd_pins clk_wiz_1/reset] [get_bd_pins mig_7series_0/sys_rst] \
  [get_bd_pins rst_clk_wiz_0_125M/ext_reset_in]
connect_bd_net [get_bd_pins axi_ethernet_0_dma/mm2s_prmry_reset_out_n] [get_bd_pins axi_ethernet_0/axi_txd_arstn]
connect_bd_net [get_bd_pins axi_ethernet_0_dma/mm2s_cntrl_reset_out_n] [get_bd_pins axi_ethernet_0/axi_txc_arstn]
connect_bd_net [get_bd_pins axi_ethernet_0_dma/s2mm_prmry_reset_out_n] [get_bd_pins axi_ethernet_0/axi_rxd_arstn]
connect_bd_net [get_bd_pins axi_ethernet_0_dma/s2mm_sts_reset_out_n] [get_bd_pins axi_ethernet_0/axi_rxs_arstn]
connect_bd_net [get_bd_pins axi_ethernet_0/phy_rst_n] [get_bd_ports phy_reset_out]
connect_bd_net [get_bd_pins axi_ethernet_0_dma/mm2s_introut] [get_bd_pins microblaze_0_xlconcat/In2]
connect_bd_net [get_bd_pins axi_ethernet_0_dma/s2mm_introut] [get_bd_pins microblaze_0_xlconcat/In1]
connect_bd_net [get_bd_pins axi_ethernet_0/interrupt] [get_bd_pins microblaze_0_xlconcat/In0]
connect_bd_net [get_bd_pins mig_7series_0/ui_addn_clk_0] [get_bd_pins axi_ethernet_0/ref_clk]
connect_bd_net [get_bd_pins clk_wiz_0/clk_out1] \
  [get_bd_pins axi_ethernet_0/gtx_clk] [get_bd_pins rst_clk_wiz_0_125M/slowest_sync_clk] \
  [get_bd_pins axi_quad_spi_0/ext_spi_clk]
connect_bd_net [get_bd_pins mig_7series_0/ui_addn_clk_1] [get_bd_pins clk_wiz_0/clk_in1] [get_bd_pins clk_wiz_1/clk_in1]
connect_bd_net -net CLK_40mhZ [get_bd_pins clk_wiz_1/clk_out3] \
  [get_bd_pins inverse_reverse_RX/clk] [get_bd_pins F1_F2_FILTER_0/clk40] [get_bd_pins AP_Generator_0/clk] \
  [get_bd_pins inverse_reverse_TX/clk] [get_bd_pins RX_deSERIALIZER/clk_div_in] \
  [get_bd_pins axi_clock_converter_0/m_axi_aclk] [get_bd_pins bit_slip/s_axi_aclk] \
  [get_bd_pins axis_clock_converter_0/s_axis_aclk] [get_bd_pins axis_clock_converter_1/m_axis_aclk] [get_bd_pins ila_0/clk] \
  [get_bd_pins TX_SERIALIZER/clk_div_in] [get_bd_pins bitslip_Generator_0/clk_40MHz] \
  [get_bd_pins axi_clock_converter_1/m_axi_aclk] [get_bd_pins rx_controller_0/s00_axi_aclk] \
  [get_bd_pins tx_controller_hier/clk_40MHz]
connect_bd_net [get_bd_pins clk_wiz_1/clk_out1] [get_bd_pins RX_deSERIALIZER/clk_in] [get_bd_pins TX_SERIALIZER/clk_in]
connect_bd_net [get_bd_ports RXD_N] [get_bd_pins DIFF_To_single_0/RXD_N]
connect_bd_net [get_bd_ports RXD_P] [get_bd_pins DIFF_To_single_0/RXD_P]
connect_bd_net -net Receiver_logic_data_in_to_device [get_bd_pins RX_deSERIALIZER/data_in_to_device] [get_bd_pins inverse_reverse_RX/data_in]
connect_bd_net -net bitslip_signal [get_bd_pins bitslip_Generator_0/bitslip] [get_bd_pins RX_deSERIALIZER/bitslip] [get_bd_pins ila_0/probe10]
connect_bd_net -net Receiver_logic_gpio_io_o1 [get_bd_pins bit_slip/gpio_io_o] \
  [get_bd_pins ila_0/probe11] [get_bd_pins bitslip_Generator_0/bitslip_ena]
connect_bd_net -net Receiver_logic_success [get_bd_pins bitslip_Generator_0/success] \
  [get_bd_pins F1_F2_FILTER_0/bit_aligned] [get_bd_pins success/gpio_io_i] [get_bd_pins ila_0/probe12]
connect_bd_net [get_bd_pins clk_wiz_0/locked] [get_bd_pins rst_clk_wiz_0_125M/dcm_locked]
connect_bd_net [get_bd_pins S_to_diff_0/out_p] [get_bd_ports txd_p]
connect_bd_net [get_bd_pins S_to_diff_0/out_n] [get_bd_ports txd_n]
connect_bd_net [get_bd_pins S_to_diff_1/out_n] [get_bd_ports rxclk_320_n]
connect_bd_net [get_bd_pins S_to_diff_1/out_p] [get_bd_ports rxclk_320_p]
connect_bd_net -net F1_F2_IN [get_bd_pins inverse_reverse_RX/data_out] \
  [get_bd_pins ila_0/probe3] [get_bd_pins bitslip_Generator_0/data_in] [get_bd_pins rx_controller_0/data_in]
connect_bd_net -net F1_F2_OUT [get_bd_pins F1_F2_FILTER_0/d_out] [get_bd_pins axis_clock_converter_0/s_axis_tdata] [get_bd_pins ila_0/probe2]
connect_bd_net -net Receiver_logic_dv [get_bd_pins F1_F2_FILTER_0/dv] [get_bd_pins axis_clock_converter_0/s_axis_tvalid] [get_bd_pins ila_0/probe4]
connect_bd_net [get_bd_pins clk_wiz_1/clk_out2] [get_bd_pins S_to_diff_1/sig_in]
connect_bd_net [get_bd_pins DIFF_To_single_0/RXD] [get_bd_pins RX_deSERIALIZER/data_in_from_pins]
connect_bd_net -net Transmitter_logic_data_out_to_pins [get_bd_pins TX_SERIALIZER/data_out_to_pins] [get_bd_pins S_to_diff_0/sig_in]
connect_bd_net -net axis_clock_converter_0_m_axis_tvalid [get_bd_pins axis_clock_converter_1/m_axis_tvalid] [get_bd_pins AP_Generator_0/datavalid]
connect_bd_net [get_bd_pins xlconstant_0/dout] [get_bd_pins axis_clock_converter_1/m_axis_tready]
connect_bd_net -net axis_clock_converter_0_m_axis_tdata [get_bd_pins axis_clock_converter_1/m_axis_tdata] [get_bd_pins xlslice_0/Din]
connect_bd_net [get_bd_pins xlslice_0/Dout] [get_bd_pins AP_Generator_0/data_in]
connect_bd_net [get_bd_pins AP_Generator_0/data_out] [get_bd_pins ila_0/probe0] [get_bd_pins tx_controller_hier/data_in]
connect_bd_net [get_bd_pins inverse_reverse_TX/data_out] [get_bd_pins ila_0/probe1] [get_bd_pins TX_SERIALIZER/data_out_from_device]
connect_bd_net [get_bd_pins axi_iic_0/iic2intc_irpt] [get_bd_pins microblaze_0_xlconcat/In5]
connect_bd_net -net TX_CONTROLLER_0_data_out [get_bd_pins tx_controller_hier/data_out] [get_bd_pins inverse_reverse_TX/data_in]
# net rst_clk_wiz_0_125M_peripheral_aresetn has one end: rst_clk_wiz_0_125M/peripheral_aresetn
connect_bd_net -net BIST_OK_0_1 [get_bd_ports BIST_OK] [get_bd_pins tx_controller_hier/BIST_OK_0]
connect_bd_net -net BIST_END_0_1 [get_bd_ports BIST_END] [get_bd_pins ila_0/probe7] [get_bd_pins tx_controller_hier/BIST_END_0]
connect_bd_net [get_bd_pins tx_controller_hier/BIST_START_0] [get_bd_ports BIST_START] [get_bd_pins ila_0/probe6]
connect_bd_net [get_bd_pins xlconstant_1/dout] [get_bd_pins inverse_reverse_TX/reverse]
connect_bd_net [get_bd_pins xlconstant_3/dout] [get_bd_pins inverse_reverse_RX/reverse]
connect_bd_net [get_bd_pins tx_controller_hier/BIST_end_to_processor] [get_bd_pins ila_0/probe5]
connect_bd_net [get_bd_pins tx_controller_hier/PS_ADC_ADDR] [get_bd_ports PS_ADC_ADDR]
connect_bd_net [get_bd_pins tx_controller_hier/CALIB_ADC_ADDR] [get_bd_ports CALIB_ADC_ADDR]
connect_bd_net [get_bd_pins tx_controller_hier/INV_TX] [get_bd_pins inverse_reverse_TX/invert] [get_bd_pins ila_0/probe8]
connect_bd_net [get_bd_pins tx_controller_hier/INV_RX] [get_bd_pins inverse_reverse_RX/invert] [get_bd_pins ila_0/probe9]
connect_bd_net [get_bd_pins tx_controller_hier/EXT_RST] [get_bd_ports EXT_RST] [get_bd_pins ila_0/probe14]
connect_bd_net [get_bd_pins bitslip_Generator_0/busy] [get_bd_pins ila_0/probe13]
connect_bd_net [get_bd_pins rx_controller_0/data_out] [get_bd_pins F1_F2_FILTER_0/d_in] [get_bd_pins ila_0/probe15]
connect_bd_net [get_bd_pins rx_controller_0/buffer_3] [get_bd_pins ila_0/probe16]

# ---- address map ----
assign_bd_address -offset 0x80000000 -range 1G -target_address_space [get_bd_addr_spaces axi_ethernet_0_dma/Data_MM2S] [get_bd_addr_segs mig_7series_0/memmap/memaddr]
assign_bd_address -offset 0xC0000000 -range 64K -target_address_space [get_bd_addr_spaces axi_ethernet_0_dma/Data_MM2S] [get_bd_addr_segs axi_bram_ctrl_0/S_AXI/Mem0]
assign_bd_address -offset 0x80000000 -range 1G -target_address_space [get_bd_addr_spaces axi_ethernet_0_dma/Data_S2MM] [get_bd_addr_segs mig_7series_0/memmap/memaddr]
assign_bd_address -offset 0xC0000000 -range 64K -target_address_space [get_bd_addr_spaces axi_ethernet_0_dma/Data_S2MM] [get_bd_addr_segs axi_bram_ctrl_0/S_AXI/Mem0]
assign_bd_address -offset 0x80000000 -range 1G -target_address_space [get_bd_addr_spaces axi_ethernet_0_dma/Data_SG] [get_bd_addr_segs mig_7series_0/memmap/memaddr]
assign_bd_address -offset 0xC0000000 -range 64K -target_address_space [get_bd_addr_spaces axi_ethernet_0_dma/Data_SG] [get_bd_addr_segs axi_bram_ctrl_0/S_AXI/Mem0]
assign_bd_address -offset 0x00000000 -range 64K -target_address_space [get_bd_addr_spaces microblaze_0/Data] [get_bd_addr_segs microblaze_0_local_memory/dlmb_bram_if_cntlr/SLMB/Mem]
assign_bd_address -offset 0x40000000 -range 64K -target_address_space [get_bd_addr_spaces microblaze_0/Data] [get_bd_addr_segs success/S_AXI/Reg]
assign_bd_address -offset 0x40010000 -range 64K -target_address_space [get_bd_addr_spaces microblaze_0/Data] [get_bd_addr_segs tx_controller_hier/BIST_CYCLES/BIST_CYCLES_from_tx_controller/S_AXI/Reg]
assign_bd_address -offset 0x40020000 -range 64K -target_address_space [get_bd_addr_spaces microblaze_0/Data] [get_bd_addr_segs tx_controller_hier/done_BIST/BIST_END_from_tx_controller/S_AXI/Reg]
assign_bd_address -offset 0x40030000 -range 64K -target_address_space [get_bd_addr_spaces microblaze_0/Data] [get_bd_addr_segs tx_controller_hier/done_LV1A/done_from_tx_controller/S_AXI/Reg]
assign_bd_address -offset 0x40040000 -range 64K -target_address_space [get_bd_addr_spaces microblaze_0/Data] [get_bd_addr_segs bit_slip/S_AXI/Reg]
assign_bd_address -offset 0x40600000 -range 64K -target_address_space [get_bd_addr_spaces microblaze_0/Data] [get_bd_addr_segs axi_uartlite_0/S_AXI/Reg]
assign_bd_address -offset 0x40800000 -range 64K -target_address_space [get_bd_addr_spaces microblaze_0/Data] [get_bd_addr_segs axi_iic_0/S_AXI/Reg]
assign_bd_address -offset 0x40C00000 -range 256K -target_address_space [get_bd_addr_spaces microblaze_0/Data] [get_bd_addr_segs axi_ethernet_0/s_axi/Reg0]
assign_bd_address -offset 0x41200000 -range 64K -target_address_space [get_bd_addr_spaces microblaze_0/Data] [get_bd_addr_segs microblaze_0_axi_intc/S_AXI/Reg]
assign_bd_address -offset 0x41C00000 -range 64K -target_address_space [get_bd_addr_spaces microblaze_0/Data] [get_bd_addr_segs axi_timer_0/S_AXI/Reg]
assign_bd_address -offset 0x41E00000 -range 64K -target_address_space [get_bd_addr_spaces microblaze_0/Data] [get_bd_addr_segs axi_ethernet_0_dma/S_AXI_LITE/Reg]
assign_bd_address -offset 0x44A00000 -range 64K -target_address_space [get_bd_addr_spaces microblaze_0/Data] [get_bd_addr_segs FIFO/S_AXI/Mem0]
assign_bd_address -offset 0x44A10000 -range 64K -target_address_space [get_bd_addr_spaces microblaze_0/Data] [get_bd_addr_segs FIFO/S_AXI_FULL/Mem1]
assign_bd_address -offset 0x44A20000 -range 64K -target_address_space [get_bd_addr_spaces microblaze_0/Data] [get_bd_addr_segs tx_controller_hier/TX_CONTROLLER_0/s00_axi/reg0]
assign_bd_address -offset 0x44A30000 -range 64K -target_address_space [get_bd_addr_spaces microblaze_0/Data] [get_bd_addr_segs rx_controller_0/S00_AXI/S00_AXI_reg]
assign_bd_address -offset 0x80000000 -range 1G -target_address_space [get_bd_addr_spaces microblaze_0/Data] [get_bd_addr_segs mig_7series_0/memmap/memaddr]
assign_bd_address -offset 0xC0000000 -range 64K -target_address_space [get_bd_addr_spaces microblaze_0/Data] [get_bd_addr_segs axi_bram_ctrl_0/S_AXI/Mem0]
assign_bd_address -offset 0x00000000 -range 64K -target_address_space [get_bd_addr_spaces microblaze_0/Instruction] [get_bd_addr_segs microblaze_0_local_memory/ilmb_bram_if_cntlr/SLMB/Mem]
assign_bd_address -offset 0x80000000 -range 1G -target_address_space [get_bd_addr_spaces microblaze_0/Instruction] [get_bd_addr_segs mig_7series_0/memmap/memaddr]
assign_bd_address -offset 0xC0000000 -range 64K -target_address_space [get_bd_addr_spaces microblaze_0/Instruction] [get_bd_addr_segs axi_bram_ctrl_0/S_AXI/Mem0]

validate_bd_design
save_bd_design
